# Altium project LoggerBoard.PrjPcb (part 2 of 2)

## Sheet CH3-Isolation.SchDoc: CH3 ISOLATION
size A4; Author: MOG; CompanyName: GIE GROUP; DrawnBy: MOG; Organization: Gie SA; Address1: Galicia 52; Address2: Mar del Plata; Address3: Buenos Aires; Address4: Argentina; DocumentNumber: 7; Revision: 0.0; SheetNumber: 8; SheetTotal: 14; Project: CP DATALOGGER; PageSetup: Record=PageOptions|CenterHorizontal=True|CenterVertical=True|PrintScale=0.94|XCorrection=1.00|YCorrection=1.00|PrintKind=0|BorderSize=5000000|LeftOffset=0|BottomOffset=0|Orientation=2|PaperLength=1000|PaperWidth=1000|Scale=100|PaperSource=7|PrintQuality=720|MediaType=1|DitherType=10|PaperKind=A4|PrintScaleMode=1
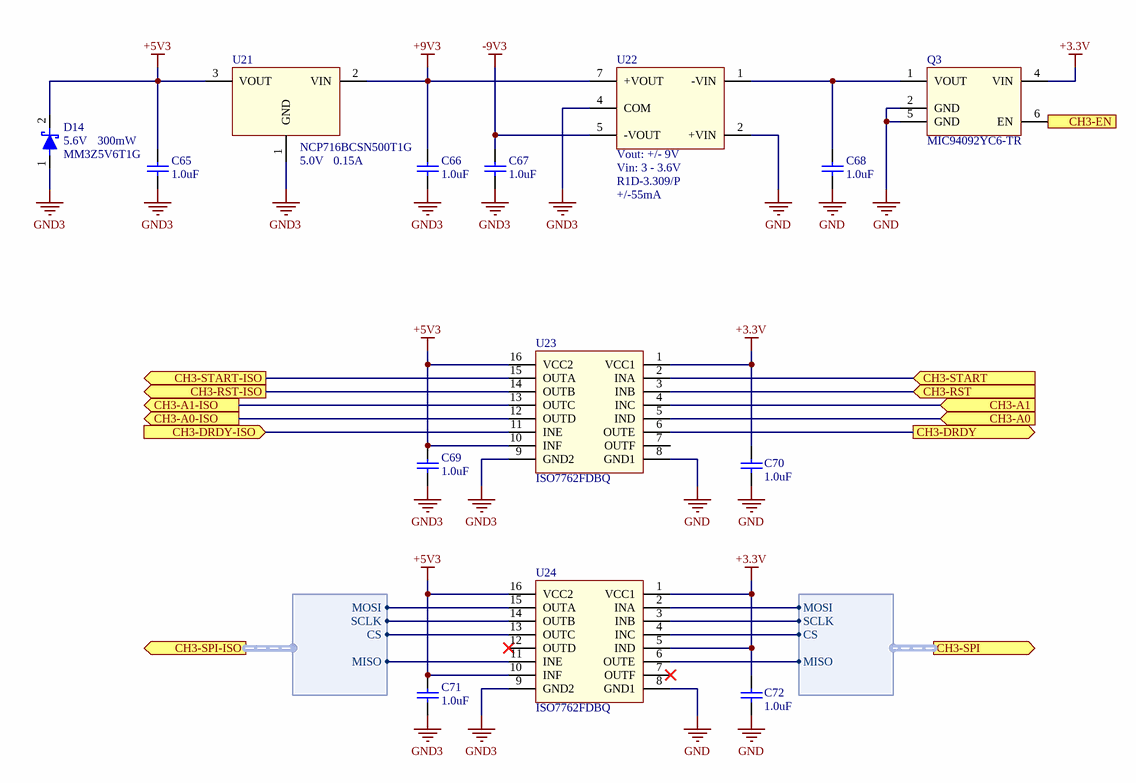
[diagram p7: CH3-Isolation.SchDoc]

### Parts
C65  value 1.0uF  [CAP-0603]  (hidden comment: C0603C105M3RAC7867)
C66  value 1.0uF  [CAP-0603]  (hidden comment: C0603C105M3RAC7867)
C67  value 1.0uF  [CAP-0603]  (hidden comment: C0603C105M3RAC7867)
C68  value 1.0uF  [CAP-0603]  (hidden comment: C0603C105M3RAC7867)
C69  value 1.0uF  [CAP-0603]  (hidden comment: C0603C105M3RAC7867)
C70  value 1.0uF  [CAP-0603]  (hidden comment: C0603C105M3RAC7867)
C71  value 1.0uF  [CAP-0603]  (hidden comment: C0603C105M3RAC7867)
C72  value 1.0uF  [CAP-0603]  (hidden comment: C0603C105M3RAC7867)
D14  Power: 300mW  Vz: 5.6V  [SOD323 - DIODE UNIDIR]  (hidden comment: MM3Z5V6T1G)
Q3  MIC94092YC6-TR  [TSSOP6]
U21  Voltage: 5.0V  Current: 0.15A  [SOT23-5]  (hidden comment: NCP716BCSN500T1G)
U22  Vout: +/- 9V  Vin: 3 - 3.6V  Current: +/-55mA  [RECOM-R1D]  (hidden comment: R1D-3.309/P)
U23  ISO7762FDBQ  [SSOP16]
U24  ISO7762FDBQ  [SSOP16]

### Ports
CH3-A0 (in), CH3-A0-ISO (out), CH3-A1 (in), CH3-A1-ISO (out), CH3-DRDY (out), CH3-DRDY-ISO (in), CH3-EN (in), CH3-RST (in), CH3-RST-ISO (out), CH3-SPI (out, harness CH3-SPI), CH3-SPI-ISO (out, harness CH3-SPI-ISO), CH3-START (in), CH3-START-ISO (out)

### Harnesses
CH3-SPI-ISO: MOSI, MISO, SCLK, CS
CH3-SPI: MOSI, MISO, SCLK, CS

### Nets
+3.3V: C70.2 C72.2 Q3.4(VIN) U23.1(VCC1) U24.1(VCC1) U24.5(IND)
+5V3: C65.2 C69.2 C71.2 D14.2(K) U21.3(VOUT) U23.10(INF) U23.16(VCC2) U24.10(INF) U24.16(VCC2)
+9V3: C66.2 U21.2(VIN) U22.7(+VOUT)
-9V3: C67.2 U22.5(-VOUT)
GND: C68.1 C70.1 C72.1 Q3.2(GND) Q3.5(GND) U22.2(+VIN) U23.8(GND1) U24.8(GND1)
GND3: C65.1 C66.1 C67.1 C69.1 C71.1 D14.1(A) U21.1(GND) U22.4(COM) U23.9(GND2) U24.9(GND2)
CH3-A0: U23.5(IND) ; port CH3-A0
CH3-A1: U23.4(INC) ; port CH3-A1
CH3-DRDY: U23.6(OUTE) ; port CH3-DRDY
CH3-EN: Q3.6(EN) ; port CH3-EN
CH3-RST: U23.3(INB) ; port CH3-RST
CH3-SPI.CS: U24.4(INC) ; port CH3-SPI.CS
CH3-SPI.MISO: U24.6(OUTE) ; port CH3-SPI.MISO
CH3-SPI.MOSI: U24.2(INA) ; port CH3-SPI.MOSI
CH3-SPI.SCLK: U24.3(INB) ; port CH3-SPI.SCLK
CH3-START: U23.2(INA) ; port CH3-START
NetC68_2: C68.2 Q3.1(VOUT) U22.1(-VIN)
NetR22_2: U24.11(INE) ; port CH3-SPI-ISO.MISO
NetU18_4: U23.12(OUTD) ; port CH3-A0-ISO
NetU18_5: U23.13(OUTC) ; port CH3-A1-ISO
NetU20_3: U23.14(OUTB) ; port CH3-RST-ISO
NetU20_4: U23.15(OUTA) ; port CH3-START-ISO
NetU20_6: U24.13(OUTC) ; port CH3-SPI-ISO.CS
NetU20_7: U24.14(OUTB) ; port CH3-SPI-ISO.SCLK
NetU20_8: U24.15(OUTA) ; port CH3-SPI-ISO.MOSI
NetU20_10: U23.11(INE) ; port CH3-DRDY-ISO

Not connected (* = marked no-connect by the designer): U23 7(OUTF); U24 7(OUTF)* 12(OUTD)*

### Notes on the sheet
- PROYECTO:
- Rev:
- NOMBRE:
- FECHA:
- REALIZO:
- REVISO:
- APROBO:
- PAG:
- HOJA:
- DE
- A4

### Library data of the parts
C65-C72 = C0603C105M3RAC7867: as C10 on sheet CH1-Input; PartNumber: C0603C105M3RAC7867; Supplier 1: Digi-Key; Supplier 2: Mouser; Supplier Part Number 1: 399-C0603C105M3RAC7867CT-ND; Supplier Part Number 2: 80-C0603C105M3R
D14 = MM3Z5V6T1G: Schottky Diode 30V 200mA SOT323; Manufacturer: OnSemiconductor; PartNumber: MM3Z5V6T1G
Q3 = MIC94092YC6-TR: Manufacturer: Microchip; PartNUmber: MIC94092YC6-TR
U21 = NCP716BCSN500T1G: IC REG LDO 0.5V 0.15A TSOT23-5; Manufacturer: ON Semiconductor; PartNumber: NCP716BCSN500T1G
U22 = R1D-3.309/P: DC DC CONVERTER +/-9V 1W; Manufacturer: Recom; Supplier 1: Digi-Key; Supplier 2: Mouser; Supplier Part Number 1: R1D-3.309/P-ND; Supplier Part Number 2: 919-R1D-3.309P; Part Number: R1D-3.309/P
U23 U24 = ISO7762FDBQ: Digital Isolator, six-channel, 4/2, 16-SSOP; Manufacturer: Texas Instruments; Supplier 1: Digi-Key; Supplier 2: Mouser; Supplier Part Number 1: 296-49452-6-ND; Supplier Part Number 2: 595-ISO7762FDBQR; PartNumber: ISO7762FDBQ

## Sheet Switch.SchDoc: SWITCH
size A4; Author: MOG; CompanyName: GIE GROUP; DrawnBy: MOG; Organization: Gie SA; Address1: Galicia 52; Address2: Mar del Plata; Address3: Buenos Aires; Address4: Argentina; DocumentNumber: 8; Revision: 0.0; SheetNumber: 9; SheetTotal: 14; Project: CP DATALOGGER; PageSetup: Record=PageOptions|CenterHorizontal=True|CenterVertical=True|PrintScale=0.94|XCorrection=1.00|YCorrection=1.00|PrintKind=0|BorderSize=5000000|LeftOffset=0|BottomOffset=0|Orientation=2|PaperLength=1000|PaperWidth=1000|Scale=100|PaperSource=7|PrintQuality=720|MediaType=1|DitherType=10|PaperKind=A4|PrintScaleMode=1
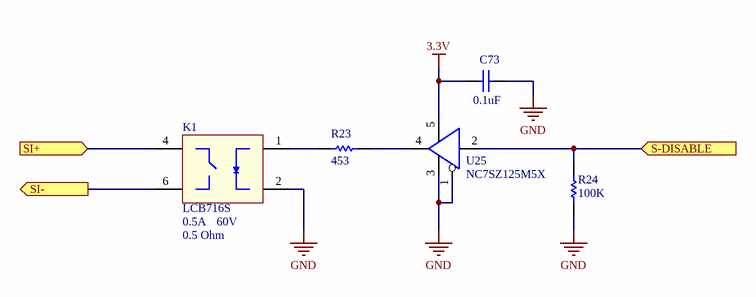
[diagram p8: Switch.SchDoc]

### Parts
C73  value 0.1uF  [CAP-0603]  (hidden comment: C0603C104K5RACAUTO)
K1  Ron: 0.5 Ohm  Current: 0.5A  Voltage: 60V  [SMD6]  (hidden comment: LCB716S)
R23  value 453  [RES-0603]  (hidden comment: RC0603FR-07453RL)
R24  value 100K  [RES-0603]  (hidden comment: RC0603FR-07100KL)
U25  NC7SZ125M5X  [SOT23-5]

### Ports
S-DISABLE (in), SI+ (in), SI- (out)

### Nets
3.3V: C73.1 U25.5(VCC)
GND: C73.2 K1.2 R24.1 U25.1(OE) U25.3(GND)
S-DISABLE: R24.2 U25.2(A) ; port S-DISABLE
NetJ4_7: K1.4 ; port SI+
NetJ4_8: K1.6 ; port SI-
NetK1_1: K1.1 R23.1
NetR23_2: R23.2 U25.4(Y)

### Notes on the sheet
- PROYECTO:
- Rev:
- NOMBRE:
- FECHA:
- REALIZO:
- REVISO:
- APROBO:
- PAG:
- HOJA:
- DE
- A4

### Library data of the parts
C73 = C0603C104K5RACAUTO: as C1 on sheet CH1-Input; PartNumber: C0603C104K5RACAUTO; Supplier 1: Digi-Key; Supplier 2: Mouser; Supplier Part Number 1: 399-6856-1-ND; Supplier Part Number 2: 80-C0603C104K5RAUTO
K1 = LCB716S: SSR RELAY SPST-NC 500MA 0-60V; Manufacturer: Ixys; PartNumber: LCB716S
R23 = RC0603FR-07453RL: RES SMD 453 OHM 1% 1/10W 0603; Manufacturer: Yageo; Power: 0.1W; Tolerance: 1%; PartNumber: RC0603FR-07453RL; Supplier 1: Digi-Key; Supplier 2: Mouser; Supplier Part Number 1: 311-887KHRCT-ND; Supplier Part Number 2: 603-RC0603FR-07887KL
R24 = RC0603FR-07100KL: RES SMD 100K OHM 1% 1/10W 0603; Manufacturer: Yageo; Power: 0.1W; Tolerance: 1%; PartNumber: RC0603FR-07100KL; Supplier 1: Digi-Key; Supplier 2: Mouser; Supplier Part Number 1: 311-100KHRCT-ND; Supplier Part Number 2: 603-RC0603FR-07100KL
U25 = NC7SZ125M5X: IC BUFF TRI-ST UHS N-INV SOT23-5; Manufacturer: Fairchild Semiconductor; Supplier 1: Digi-Key; Supplier Part Number 1: NC7SZ125M5CT-ND; Supplier 2: Mouser; Supplier Part Number 2: 512-NC7SZ125M5X; PartNumber: NC7SZ125M5X

## Sheet MicrocontrollerPorts.SchDoc: MICROCONTROLLER - PORTS
size A4; Author: MOG; CompanyName: GIE GROUP; DrawnBy: MOG; Organization: Gie SA; Address1: Galicia 52; Address2: Mar del Plata; Address3: Buenos Aires; Address4: Argentina; DocumentNumber: 11; Revision: 0.0; SheetNumber: 10; SheetTotal: 14; Project: CP DATALOGGER; PageSetup: Record=PageOptions|CenterHorizontal=True|CenterVertical=True|PrintScale=0.94|XCorrection=1.00|YCorrection=1.00|PrintKind=0|BorderSize=5000000|LeftOffset=0|BottomOffset=0|Orientation=2|PaperLength=1000|PaperWidth=1000|Scale=100|PaperSource=7|PrintQuality=720|MediaType=1|DitherType=10|PaperKind=A4|PrintScaleMode=1
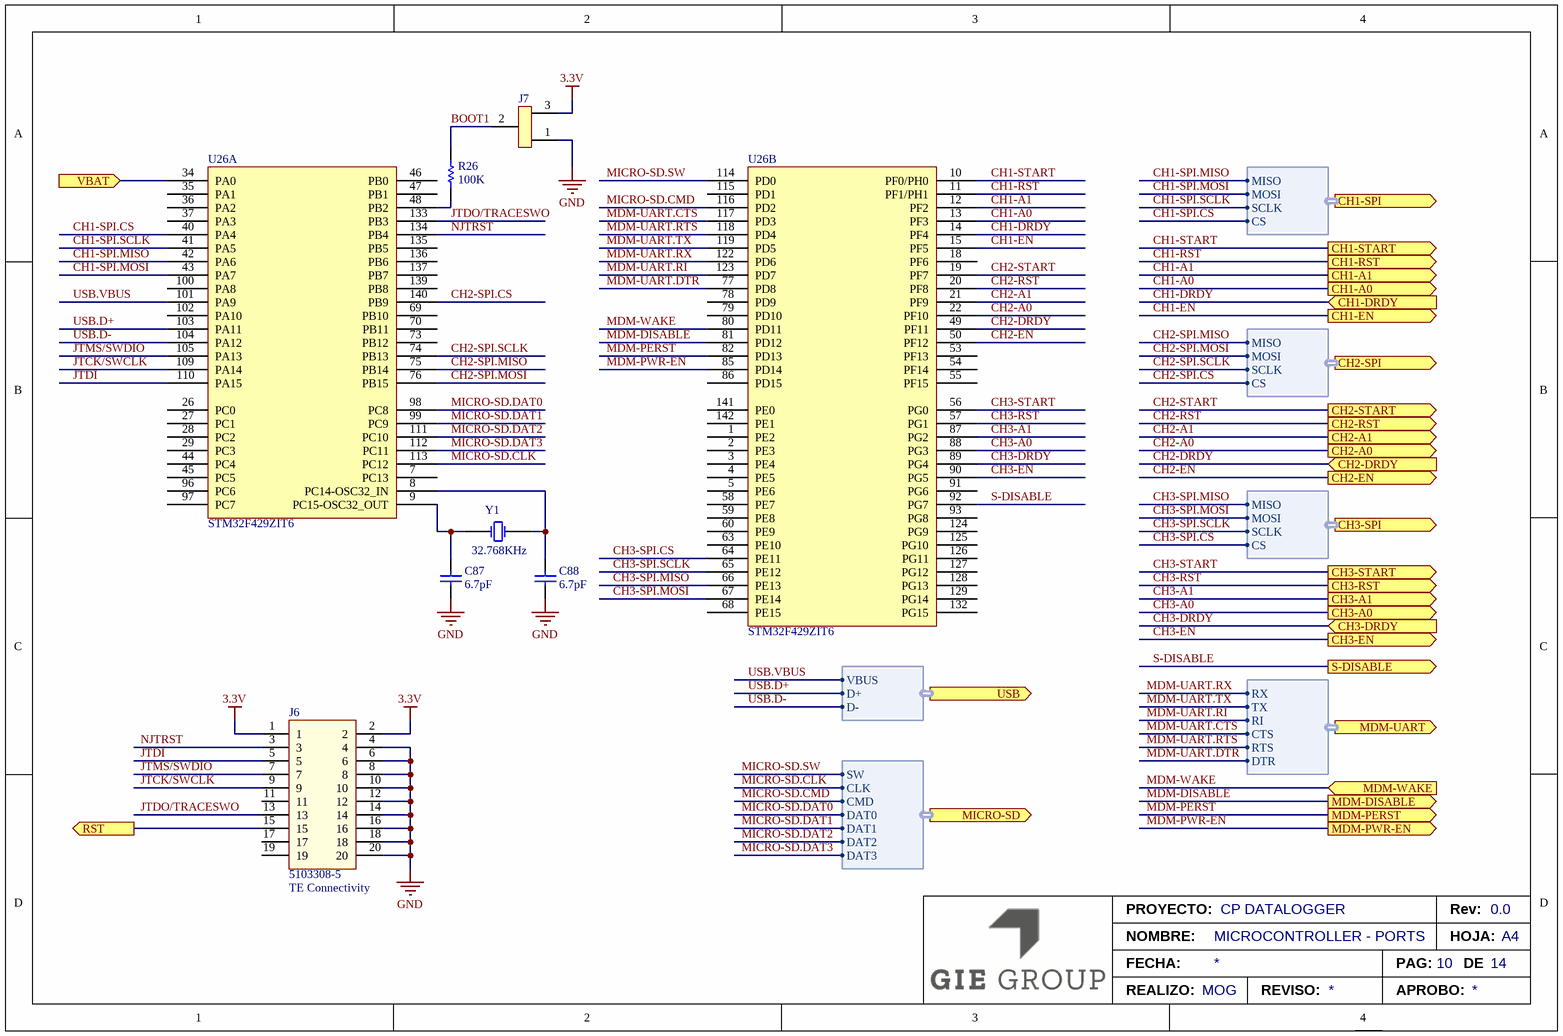
[diagram p9: MicrocontrollerPorts.SchDoc]

### Parts
C87  value 6.7pF  [CAP-0603]  (hidden comment: CBR06C679B5GAC)
C88  value 6.7pF  [CAP-0603]  (hidden comment: CBR06C679B5GAC)
J6  Manufacturer: TE Connectivity  [TE-5103308-5]  (hidden comment: 5103308-5)
J7  PRPC003SAAN-RC  [PIN3]  (value not drawn)
R26  value 100K  [RES-0603]  (hidden comment: RC0603FR-07100KL)
U26  STM32F429ZIT6  [LQFP144]  (parts A,B of 3)
Y1  value 32.768KHz  [XTAL-ABS07]  (hidden comment: ABS07-32.768KHZ-7-T)

### Ports
CH1-A0 (out), CH1-A1 (out), CH1-DRDY (in), CH1-EN (out), CH1-RST (out), CH1-SPI (out, harness CH1-SPI), CH1-START (out), CH2-A0 (out), CH2-A1 (out), CH2-DRDY (in), CH2-EN (out), CH2-RST (out), CH2-SPI (out, harness CH2-SPI), CH2-START (out), CH3-A0 (out), CH3-A1 (out), CH3-DRDY (in), CH3-EN (out), CH3-RST (out), CH3-SPI (out, harness CH3-SPI), CH3-START (out), MDM-DISABLE (out), MDM-PERST (out), MDM-PWR-EN (out), MDM-UART (out, harness MDM-UART), MDM-WAKE (in), MICRO-SD (out, harness MICRO-SD), RST (out), S-DISABLE (out), USB (out, harness USB), VBAT (in)

### Harnesses
CH1-SPI: MOSI, MISO, SCLK, CS
CH2-SPI: MOSI, MISO, SCLK, CS
CH3-SPI: MOSI, MISO, SCLK, CS
MDM-UART: RX, TX, RI, CTS, RTS, DTR
USB: D-, D+, VBUS
MICRO-SD: SW, CLK, CMD, DAT0, DAT1, DAT2, DAT3

### Nets
3.3V: J6.1 J6.2 J7.3
GND: C87.1 C88.1 J6.4 J6.6 J6.8 J6.10 J6.12 J6.14 J6.16 J6.18 J6.20 J7.1
BOOT1: J7.2 R26.2
CH1-A0: U26.13(PF3) ; port CH1-A0
CH1-A1: U26.12(PF2) ; port CH1-A1
CH1-DRDY: U26.14(PF4) ; port CH1-DRDY
CH1-EN: U26.15(PF5) ; port CH1-EN
CH1-RST: U26.11(PF1/PH1) ; port CH1-RST
CH1-SPI.CS: U26.40(PA4) ; port CH1-SPI.CS
CH1-SPI.MISO: U26.42(PA6) ; port CH1-SPI.MISO
CH1-SPI.MOSI: U26.43(PA7) ; port CH1-SPI.MOSI
CH1-SPI.SCLK: U26.41(PA5) ; port CH1-SPI.SCLK
CH1-START: U26.10(PF0/PH0) ; port CH1-START
CH2-A0: U26.22(PF10) ; port CH2-A0
CH2-A1: U26.21(PF9) ; port CH2-A1
CH2-DRDY: U26.49(PF11) ; port CH2-DRDY
CH2-EN: U26.50(PF12) ; port CH2-EN
CH2-RST: U26.20(PF8) ; port CH2-RST
CH2-SPI.CS: U26.140(PB9) ; port CH2-SPI.CS
CH2-SPI.MISO: U26.75(PB14) ; port CH2-SPI.MISO
CH2-SPI.MOSI: U26.76(PB15) ; port CH2-SPI.MOSI
CH2-SPI.SCLK: U26.74(PB13) ; port CH2-SPI.SCLK
CH2-START: U26.19(PF7) ; port CH2-START
CH3-A0: U26.88(PG3) ; port CH3-A0
CH3-A1: U26.87(PG2) ; port CH3-A1
CH3-DRDY: U26.89(PG4) ; port CH3-DRDY
CH3-EN: U26.90(PG5) ; port CH3-EN
CH3-RST: U26.57(PG1) ; port CH3-RST
CH3-SPI.CS: U26.64(PE11) ; port CH3-SPI.CS
CH3-SPI.MISO: U26.66(PE13) ; port CH3-SPI.MISO
CH3-SPI.MOSI: U26.67(PE14) ; port CH3-SPI.MOSI
CH3-SPI.SCLK: U26.65(PE12) ; port CH3-SPI.SCLK
CH3-START: U26.56(PG0) ; port CH3-START
JTCK/SWCLK: J6.9 U26.109(PA14)
JTDI: J6.5 U26.110(PA15)
JTDO/TRACESWO: J6.13 U26.133(PB3)
JTMS/SWDIO: J6.7 U26.105(PA13)
MDM-DISABLE: U26.81(PD12) ; port MDM-DISABLE
MDM-PERST: U26.82(PD13) ; port MDM-PERST
MDM-PWR-EN: U26.85(PD14) ; port MDM-PWR-EN
MDM-UART.CTS: U26.117(PD3) ; port MDM-UART.CTS
MDM-UART.DTR: U26.77(PD8) ; port MDM-UART.DTR
MDM-UART.RI: U26.123(PD7) ; port MDM-UART.RI
MDM-UART.RTS: U26.118(PD4) ; port MDM-UART.RTS
MDM-UART.RX: U26.122(PD6) ; port MDM-UART.RX
MDM-UART.TX: U26.119(PD5) ; port MDM-UART.TX
MDM-WAKE: U26.80(PD11) ; port MDM-WAKE
MICRO-SD.CLK: U26.113(PC12) ; port MICRO-SD.CLK
MICRO-SD.CMD: U26.116(PD2) ; port MICRO-SD.CMD
MICRO-SD.DAT0: U26.98(PC8) ; port MICRO-SD.DAT0
MICRO-SD.DAT1: U26.99(PC9) ; port MICRO-SD.DAT1
MICRO-SD.DAT2: U26.111(PC10) ; port MICRO-SD.DAT2
MICRO-SD.DAT3: U26.112(PC11) ; port MICRO-SD.DAT3
MICRO-SD.SW: U26.114(PD0) ; port MICRO-SD.SW
NJTRST: J6.3 U26.134(PB4)
RST: J6.15 ; port RST
S-DISABLE: U26.92(PG7) ; port S-DISABLE
USB.D+: U26.103(PA11) ; port USB.D+
USB.D-: U26.104(PA12) ; port USB.D-
USB.VBUS: U26.101(PA9) ; port USB.VBUS
NetC87_2: C87.2 U26.9(PC15-OSC32_OUT) Y1.2(OSC2)
NetC88_2: C88.2 U26.8(PC14-OSC32_IN) Y1.1(OSC1)
NetR26_1: R26.1 U26.48(PB2)
NetU26_34: U26.34(PA0) ; port VBAT

Not connected (* = marked no-connect by the designer): J6 11 17 19; U26 1(PE2) 2(PE3) 3(PE4) 4(PE5) 5(PE6) 7(PC13) 18(PF6) 26(PC0) 27(PC1) 28(PC2) 29(PC3) 35(PA1) 36(PA2) 37(PA3) 44(PC4) 45(PC5) 46(PB0) 47(PB1) 53(PF13) 54(PF14) 55(PF15) 58(PE7) 59(PE8) 60(PE9) 63(PE10) 68(PE15) 69(PB10) 70(PB11) 73(PB12) 78(PD9) 79(PD10) 86(PD15) 91(PG6) 93(PG8) 96(PC6) 97(PC7) 100(PA8) 102(PA10) 115(PD1) 124(PG9) 125(PG10) 126(PG11) 127(PG12) 128(PG13) 129(PG14) 132(PG15) 135(PB5) 136(PB6) 137(PB7) 139(PB8) 141(PE0) 142(PE1)

### Notes on the sheet
- PROYECTO:
- Rev:
- NOMBRE:
- FECHA:
- REALIZO:
- REVISO:
- APROBO:
- PAG:
- HOJA:
- DE
- A4

### Library data of the parts
C87 C88 = CBR06C679B5GAC: CAP CER 6.7 pF 50V C0G 0603; Manufacturer: Kemet; Tolerance: +/-0.1pF; PartNumber: CBR06C679B5GAC; Supplier 1: Digi-Key; Supplier 2: Mouser; Supplier Part Number 1: 399-C0805C155K4RAC7800CT-ND; Supplier Part Number 2: 80-C0805C155K4R; Voltage: 50V
J6 = 5103308-5: CONN HEADER VERT 20POS 2.54MM; PartNumber: 5103308-5
J7 = PRPC003SAAN-RC: CONN HEADER .100" SNGL STR 3POS; Manufacturer: Sullins Connector Solutions; PartNumber: PRPC003SAAN-RC; Supplier 1: Digi-Key; Supplier Part Number 1: S1011EC-03-ND
R26 = RC0603FR-07100KL: as R24 on sheet Switch; Tolerance: 1%; PartNumber: RC0603FR-07100KL; Supplier 1: Digi-Key; Supplier 2: Mouser; Supplier Part Number 1: 311-100KHRCT-ND; Supplier Part Number 2: 603-RC0603FR-07100KL
U26 = STM32F429ZIT6: IC MCU 32BIT 2MB FLASH 144LQFP; Manufacturer: STMicroelectronics; PartNumber: STM32F429ZIT6
Y1 = ABS07-32.768KHZ-7-T: CRYSTAL 32.768KHZ 7PF SMD; Manufacturer: Abracon; PartNumber: ABS07-32.768KHZ-7-T; Supplier 1: Digi-Key; Supplier Part Number 1: 535-9543-1-ND; Supplier 2: Mouser; Supplier Part Number 2: 815-ABS07-32.768K7T

## Sheet Power.SchDoc: CH1 INPUT
size A4; Author: MOG; CompanyName: GIE GROUP; DrawnBy: MOG; Organization: Gie SA; Address1: Galicia 52; Address2: Mar del Plata; Address3: Buenos Aires; Address4: Argentina; DocumentNumber: 1; Revision: 0.0; SheetNumber: 11; SheetTotal: 11; Project: CP DATALOGGER; PageSetup: Record=PageOptions|CenterHorizontal=True|CenterVertical=True|PrintScale=0.94|XCorrection=1.00|YCorrection=1.00|PrintKind=0|BorderSize=5000000|LeftOffset=0|BottomOffset=0|Orientation=2|PaperLength=1000|PaperWidth=1000|Scale=100|PaperSource=7|PrintQuality=720|MediaType=1|DitherType=10|PaperKind=A4|PrintScaleMode=1

### Notes on the sheet
- PROYECTO:
- Rev:
- NOMBRE:
- FECHA:
- REALIZO:
- REVISO:
- APROBO:
- PAG:
- HOJA:
- DE
- A4

## Sheet MicrocontrollerControl.SchDoc: MICROCONTROLLER - CONTROL
size A4; Author: MOG; CompanyName: GIE GROUP; DrawnBy: MOG; Organization: Gie SA; Address1: Galicia 52; Address2: Mar del Plata; Address3: Buenos Aires; Address4: Argentina; DocumentNumber: 10; Revision: 0.0; SheetNumber: 12; SheetTotal: 14; Project: CP DATALOGGER; PageSetup: Record=PageOptions|CenterHorizontal=True|CenterVertical=True|PrintScale=0.94|XCorrection=1.00|YCorrection=1.00|PrintKind=0|BorderSize=5000000|LeftOffset=0|BottomOffset=0|Orientation=2|PaperLength=1000|PaperWidth=1000|Scale=100|PaperSource=7|PrintQuality=720|MediaType=1|DitherType=10|PaperKind=A4|PrintScaleMode=1
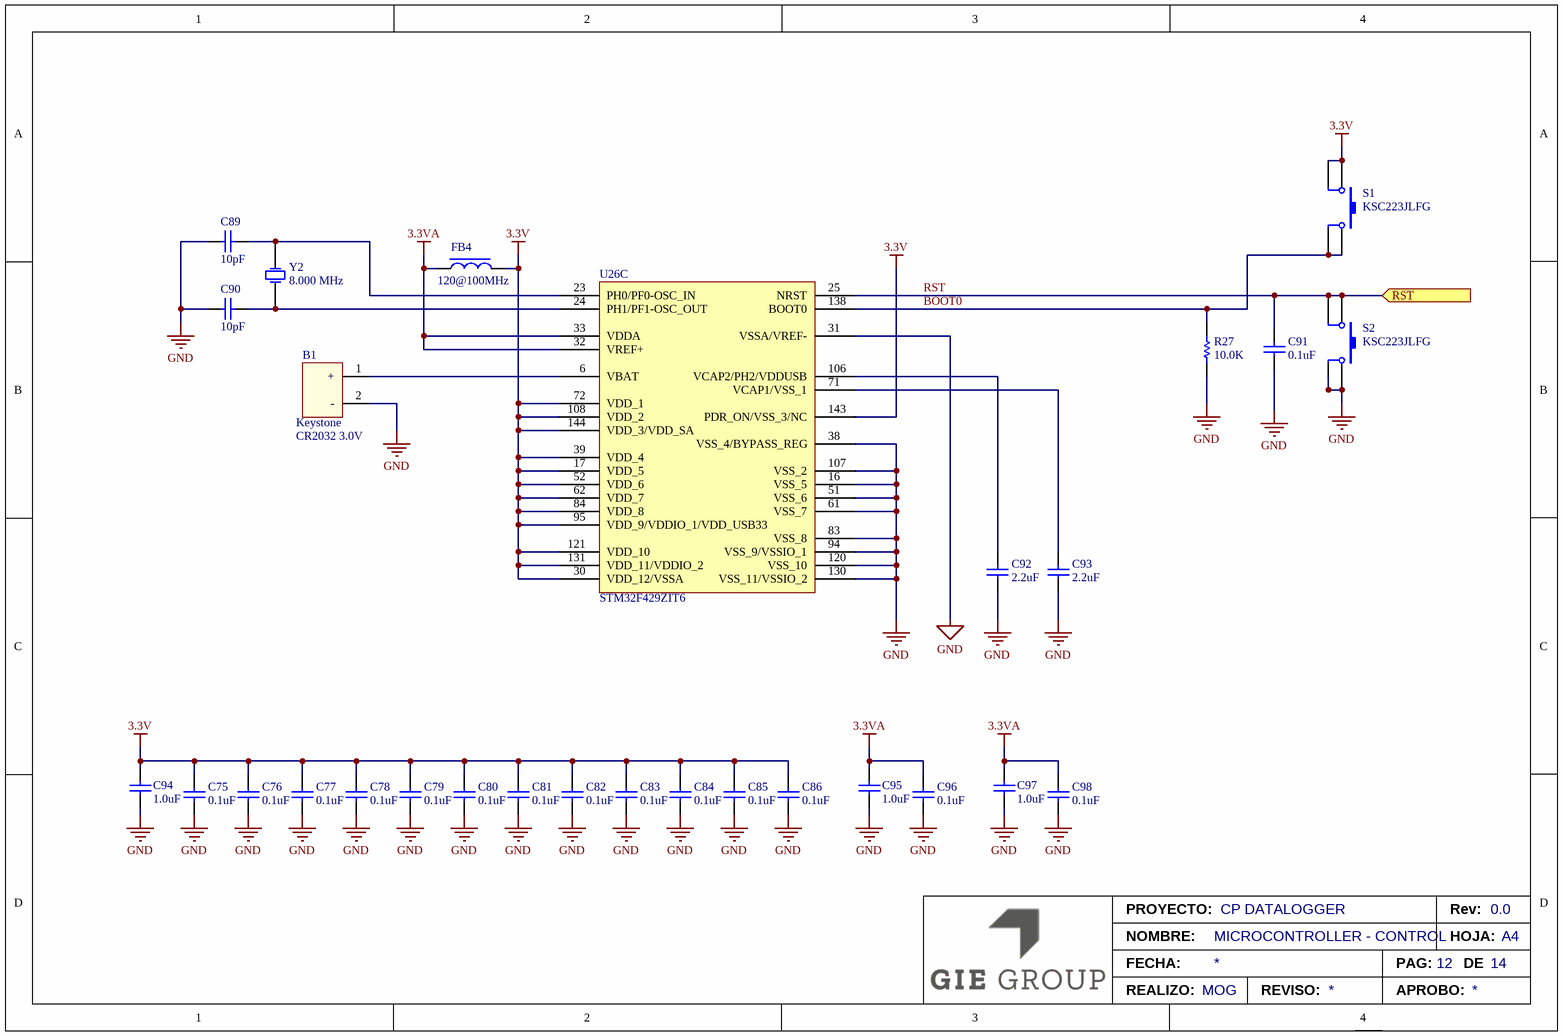
[diagram p10: MicrocontrollerControl.SchDoc]

### Parts
B1  Manufacturer: Keystone  Batery: CR2032 3.0V  [Holder-CR2032-103]  (hidden comment: 101)
C75  value 0.1uF  [CAP-0603]  (hidden comment: C0603C104K5RACAUTO)
C76  value 0.1uF  [CAP-0603]  (hidden comment: C0603C104K5RACAUTO)
C77  value 0.1uF  [CAP-0603]  (hidden comment: C0603C104K5RACAUTO)
C78  value 0.1uF  [CAP-0603]  (hidden comment: C0603C104K5RACAUTO)
C79  value 0.1uF  [CAP-0603]  (hidden comment: C0603C104K5RACAUTO)
C80  value 0.1uF  [CAP-0603]  (hidden comment: C0603C104K5RACAUTO)
C81  value 0.1uF  [CAP-0603]  (hidden comment: C0603C104K5RACAUTO)
C82  value 0.1uF  [CAP-0603]  (hidden comment: C0603C104K5RACAUTO)
C83  value 0.1uF  [CAP-0603]  (hidden comment: C0603C104K5RACAUTO)
C84  value 0.1uF  [CAP-0603]  (hidden comment: C0603C104K5RACAUTO)
C85  value 0.1uF  [CAP-0603]  (hidden comment: C0603C104K5RACAUTO)
C86  value 0.1uF  [CAP-0603]  (hidden comment: C0603C104K5RACAUTO)
C89  value 10pF  [CAP-0603]  (hidden comment: C0603C100K3GAC7867)
C90  value 10pF  [CAP-0603]  (hidden comment: C0603C100K3GAC7867)
C91  value 0.1uF  [CAP-0603]  (hidden comment: C0603C104K5RACAUTO)
C92  value 2.2uF  [CAP-0603]  (hidden comment: C0603C225M9PAC7867)
C93  value 2.2uF  [CAP-0603]  (hidden comment: C0603C225M9PAC7867)
C94  value 1.0uF  [CAP-0603]  (hidden comment: C0603C105M3RAC7867)
C95  value 1.0uF  [CAP-0603]  (hidden comment: C0603C105M3RAC7867)
C96  value 0.1uF  [CAP-0603]  (hidden comment: C0603C104K5RACAUTO)
C97  value 1.0uF  [CAP-0603]  (hidden comment: C0603C105M3RAC7867)
C98  value 0.1uF  [CAP-0603]  (hidden comment: C0603C104K5RACAUTO)
FB4  value 120@100MHz  [IND-0603]  (hidden comment: Z0603C121GPWZT)
R27  value 10.0K  [RES-0603]  (hidden comment: RC0603FR-0710KL)
S1  KSC223JLFG  [KSC_J]
S2  KSC223JLFG  [KSC_J]
U26  STM32F429ZIT6  [LQFP144]  (part C of 3)
Y2  value 8.000 MHz  [XTAL-ABM7]  (hidden comment: ABM7-16.000MHZ-D-2-Y-T)

### Ports
RST (in)

### Nets
3.3V: C75.2 C76.2 C77.2 C78.2 C79.2 C80.2 C81.2 C82.2 C83.2 C84.2 C85.2 C86.2 C94.2 FB4.2 S1.1 S1.4 U26.17(VDD_5) U26.30(VDD_12/VSSA) U26.39(VDD_4) U26.52(VDD_6) U26.62(VDD_7) U26.72(VDD_1) U26.84(VDD_8) U26.95(VDD_9/VDDIO_1/VDD_USB33) U26.108(VDD_2) U26.121(VDD_10) U26.131(VDD_11/VDDIO_2) U26.143(PDR_ON/VSS_3/NC) U26.144(VDD_3/VDD_SA)
3.3VA: C95.2 C96.2 C97.2 C98.2 FB4.1 U26.32(VREF+) U26.33(VDDA)
GND: B1.2(-) C75.1 C76.1 C77.1 C78.1 C79.1 C80.1 C81.1 C82.1 C83.1 C84.1 C85.1 C86.1 C89.1 C90.1 C91.1 C92.1 C93.1 C94.1 C95.1 C96.1 C97.1 C98.1 R27.1 S2.2 S2.3 U26.16(VSS_5) U26.31(VSSA/VREF-) U26.38(VSS_4/BYPASS_REG) U26.51(VSS_6) U26.61(VSS_7) U26.83(VSS_8) U26.94(VSS_9/VSSIO_1) U26.107(VSS_2) U26.120(VSS_10) U26.130(VSS_11/VSSIO_2)
BOOT0: R27.2 S1.2 S1.3 U26.138(BOOT0)
RST: C91.2 S2.1 S2.4 U26.25(NRST) ; port RST
NetB1_1: B1.1(+) U26.6(VBAT)
NetC89_2: C89.2 U26.23(PH0/PF0-OSC_IN) Y2.2(OSC2)
NetC90_2: C90.2 U26.24(PH1/PF1-OSC_OUT) Y2.1(OSC1)
NetC92_2: C92.2 U26.106(VCAP2/PH2/VDDUSB)
NetC93_2: C93.2 U26.71(VCAP1/VSS_1)

### Notes on the sheet
- PROYECTO:
- Rev:
- NOMBRE:
- FECHA:
- REALIZO:
- REVISO:
- APROBO:
- PAG:
- HOJA:
- DE
- A4

### Library data of the parts
B1 = Holder 101: HOLDER BATTERY COIN 20MM TH; PartNumber: 101; Supplier 1: Digi-Key; Supplier Part Number 1: 36-101-ND; Supplier 2: Mouser; Supplier Part Number 2: 534-101
C75-C86 C91 C96 C98 = C0603C104K5RACAUTO: CAP CER 0.1uF 50V X7R 0603; Manufacturer: Kemet; Tolerance: 10%; Voltage: 50; PartNumber: C0603C104K5RACAUTO; Supplier 1: Digi-Key; Supplier 2: Mouser; Supplier Part Number 1: 399-6856-1-ND; Supplier Part Number 2: 80-C0603C104K5RAUTO
C89 C90 = C0603C100K3GAC7867: CAP CER 10 pF 25V C0G 0603; Manufacturer: Kemet; Tolerance: 10%; PartNumber: C0603C100K3GAC7867; Voltage: 25V
C92 C93 = C0603C225M9PAC7867: CAP CER 2.2uF 6.3V X5R 0603; Manufacturer: Kemet; Tolerance: 20%; Voltage: 6.3; PartNumber: C0603C225M9PAC7867
C94 C95 C97 = C0603C105M3RAC7867: CAP CER 1uF 25V X7R 0603; Manufacturer: Kemet; Tolerance: 20%; Voltage: 25; PartNumber: C0603C105M3RAC7867; Supplier 1: Digi-Key; Supplier 2: Mouser; Supplier Part Number 1: 399-C0603C105M3RAC7867CT-ND; Supplier Part Number 2: 80-C0603C105M3R
FB4 = Z0603C121GPWZT: Ferrite Bead 120Ohms 900mA 25% DCR=130m; Manufacturer: Kemet; PartNumber: Z0603C121GPWZT; Supplier 1: Digi-Key; Supplier 2: Mouser; Supplier Part Number 1: 399-Z0603C121GPWZTCT-ND; Supplier Part Number 2: 80-Z0603C121GPWZT
R27 = RC0603FR-0710KL: RES SMD 10.0K OHM 1% 1/10W 0603; Manufacturer: Yageo; Power: 0.1W; Tolerance: 1%; PartNumber: RC0603FR-0710KL; Supplier 1: Digi-Key; Supplier Part Number 1: 311-100KCRCT-ND; Supplier 2: Mouser; Supplier Part Number 2: 603-RC0805FR-07100KL
S1 S2 = KSC223JLFG: SWITCH TACTILE SPST-NO 0.01A 32V; Manufacturer: C&K; Part Number: KSC223JLFG; Supplier 1: Digi-Key; Supplier Part Number 1: CKN12117CT-ND; Supplier 2: Mouser; Supplier Part Number 2: 611-KSC223JLFG
U26 = STM32F429ZIT6: IC MCU 32BIT 2MB FLASH 144LQFP; Manufacturer: STMicroelectronics; PartNumber: STM32F429ZIT6
Y2 = ABM7-8.000MHZ-D2Y-T: CRYSTAL 8.0000 MHZ 18PF SMD; Manufacturer: Abracon; PartNumber: ABM7-16.000MHZ-D-2-Y-T

## Nets that join several sheets
3.3V: Switch (C73.1 U25.5), MicrocontrollerPorts (J6.1 J6.2 J7.3), MicrocontrollerControl (29 pins)
+3.3V: CH1-Isolation (6 pins), CH2-Isolation (6 pins), Modem (Q4.4), CH3-Isolation (6 pins)
+5V1: CH1-Input (C13.2 FB1.2 U4.15), CH1-Isolation (9 pins)
+5V2: CH2-Input (C42.2 FB2.2 U12.15), CH2-Isolation (9 pins)
+5V3: CH3-Input (C63.2 FB3.2 U20.15), CH3-Isolation (9 pins)
+9V1: CH1-Input (C1.2 C3.2 U2.8 U3.5), CH1-Isolation (C16.2 U5.2 U6.7)
+9V2: CH2-Input (C30.2 C32.2 U10.8 U11.5), CH2-Isolation (C45.2 U13.2 U14.7)
+9V3: CH3-Input (C52.2 C54.2 U18.8 U19.5), CH3-Isolation (C66.2 U21.2 U22.7)
-9V1: CH1-Input (5 pins), CH1-Isolation (C17.2 U6.5)
-9V2: CH2-Input (5 pins), CH2-Isolation (C46.2 U14.5)
-9V3: CH3-Input (5 pins), CH3-Isolation (C67.2 U22.5)
GND: CH1-Isolation (8 pins), CH2-Isolation (8 pins), Modem (42 pins), CH3-Isolation (8 pins), Switch (5 pins), MicrocontrollerPorts (12 pins), MicrocontrollerControl (36 pins)
GND1: General (J4.2), CH1-Input (25 pins), CH1-Isolation (10 pins), CH2-Input (R15.1)
GND2: General (J4.4), CH2-Input (24 pins), CH2-Isolation (10 pins)
GND3: General (J4.6), CH3-Input (25 pins), CH3-Isolation (10 pins)
CH1-A0: CH1-Isolation (U7.5), MicrocontrollerPorts (U26.13)
CH1-A1: CH1-Isolation (U7.4), MicrocontrollerPorts (U26.12)
CH1-DRDY: CH1-Isolation (U7.6), MicrocontrollerPorts (U26.14)
CH1-EN: CH1-Isolation (Q1.6), MicrocontrollerPorts (U26.15)
CH1-RST: CH1-Isolation (U7.3), MicrocontrollerPorts (U26.11)
CH1-SPI.CS: CH1-Isolation (U8.4), MicrocontrollerPorts (U26.40)
CH1-SPI.MISO: CH1-Isolation (U8.6), MicrocontrollerPorts (U26.42)
CH1-SPI.MOSI: CH1-Isolation (U8.2), MicrocontrollerPorts (U26.43)
CH1-SPI.SCLK: CH1-Isolation (U8.3), MicrocontrollerPorts (U26.41)
CH1-START: CH1-Isolation (U7.2), MicrocontrollerPorts (U26.10)
CH2-A0: CH2-Isolation (U15.5), MicrocontrollerPorts (U26.22)
CH2-A1: CH2-Isolation (U15.4), MicrocontrollerPorts (U26.21)
CH2-DRDY: CH2-Isolation (U15.6), MicrocontrollerPorts (U26.49)
CH2-EN: CH2-Isolation (Q2.6), MicrocontrollerPorts (U26.50)
CH2-RST: CH2-Isolation (U15.3), MicrocontrollerPorts (U26.20)
CH2-SPI.CS: CH2-Isolation (U16.4), MicrocontrollerPorts (U26.140)
CH2-SPI.MISO: CH2-Isolation (U16.6), MicrocontrollerPorts (U26.75)
CH2-SPI.MOSI: CH2-Isolation (U16.2), MicrocontrollerPorts (U26.76)
CH2-SPI.SCLK: CH2-Isolation (U16.3), MicrocontrollerPorts (U26.74)
CH2-START: CH2-Isolation (U15.2), MicrocontrollerPorts (U26.19)
CH3-A0: CH3-Isolation (U23.5), MicrocontrollerPorts (U26.88)
CH3-A1: CH3-Isolation (U23.4), MicrocontrollerPorts (U26.87)
CH3-DRDY: CH3-Isolation (U23.6), MicrocontrollerPorts (U26.89)
CH3-EN: CH3-Isolation (Q3.6), MicrocontrollerPorts (U26.90)
CH3-RST: CH3-Isolation (U23.3), MicrocontrollerPorts (U26.57)
CH3-SPI.CS: CH3-Isolation (U24.4), MicrocontrollerPorts (U26.64)
CH3-SPI.MISO: CH3-Isolation (U24.6), MicrocontrollerPorts (U26.66)
CH3-SPI.MOSI: CH3-Isolation (U24.2), MicrocontrollerPorts (U26.67)
CH3-SPI.SCLK: CH3-Isolation (U24.3), MicrocontrollerPorts (U26.65)
CH3-START: CH3-Isolation (U23.2), MicrocontrollerPorts (U26.56)
MDM-DISABLE: Modem (J1.20), MicrocontrollerPorts (U26.81)
MDM-PERST: Modem (J1.22), MicrocontrollerPorts (U26.82)
MDM-PWR-EN: Modem (Q4.6), MicrocontrollerPorts (U26.85)
MDM-UART.CTS: Modem (J1.25), MicrocontrollerPorts (U26.117)
MDM-UART.DTR: Modem (J1.31), MicrocontrollerPorts (U26.77)
MDM-UART.RI: Modem (J1.17), MicrocontrollerPorts (U26.123)
MDM-UART.RTS: Modem (J1.23), MicrocontrollerPorts (U26.118)
MDM-UART.RX: Modem (J1.13), MicrocontrollerPorts (U26.122)
MDM-UART.TX: Modem (J1.11), MicrocontrollerPorts (U26.119)
MDM-WAKE: Modem (J1.1), MicrocontrollerPorts (U26.80)
NetGDT1_1: General (J4.1), CH1-Input (GDT1.1 PTC1.1)
NetGDT2_1: General (J4.3), CH2-Input (GDT2.1 PTC2.1)
NetGDT3_1: General (J4.5), CH3-Input (GDT3.1 R20.I1)
NetJ4_7: General (J4.7), Switch (K1.4)
NetJ4_8: General (J4.8), Switch (K1.6)
NetR6_2: CH1-Input (R6.2 U4.9), CH1-Isolation (U8.11)
NetR16_2: CH2-Input (R16.2 U12.9), CH2-Isolation (U16.11)
NetR22_2: CH3-Input (R22.2 U20.9), CH3-Isolation (U24.11)
NetU2_4: CH1-Input (U2.4), CH1-Isolation (U7.12)
NetU2_5: CH1-Input (U2.5), CH1-Isolation (U7.13)
NetU4_3: CH1-Input (U4.3), CH1-Isolation (U7.14)
NetU4_4: CH1-Input (U4.4), CH1-Isolation (U7.15)
NetU4_6: CH1-Input (U4.6), CH1-Isolation (U8.13)
NetU4_7: CH1-Input (U4.7), CH1-Isolation (U8.14)
NetU4_8: CH1-Input (U4.8), CH1-Isolation (U8.15)
NetU4_10: CH1-Input (U4.10), CH1-Isolation (U7.11)
NetU10_4: CH2-Input (U10.4), CH2-Isolation (U15.12)
NetU10_5: CH2-Input (U10.5), CH2-Isolation (U15.13)
NetU12_3: CH2-Input (U12.3), CH2-Isolation (U15.14)
NetU12_4: CH2-Input (U12.4), CH2-Isolation (U15.15)
NetU12_6: CH2-Input (U12.6), CH2-Isolation (U16.13)
NetU12_7: CH2-Input (U12.7), CH2-Isolation (U16.14)
NetU12_8: CH2-Input (U12.8), CH2-Isolation (U16.15)
NetU12_10: CH2-Input (U12.10), CH2-Isolation (U15.11)
NetU18_4: CH3-Input (U18.4), CH3-Isolation (U23.12)
NetU18_5: CH3-Input (U18.5), CH3-Isolation (U23.13)
NetU20_3: CH3-Input (U20.3), CH3-Isolation (U23.14)
NetU20_4: CH3-Input (U20.4), CH3-Isolation (U23.15)
NetU20_6: CH3-Input (U20.6), CH3-Isolation (U24.13)
NetU20_7: CH3-Input (U20.7), CH3-Isolation (U24.14)
NetU20_8: CH3-Input (U20.8), CH3-Isolation (U24.15)
NetU20_10: CH3-Input (U20.10), CH3-Isolation (U23.11)
RST: MicrocontrollerPorts (J6.15), MicrocontrollerControl (C91.2 S2.1 S2.4 U26.25)
S-DISABLE: Switch (R24.2 U25.2), MicrocontrollerPorts (U26.92)